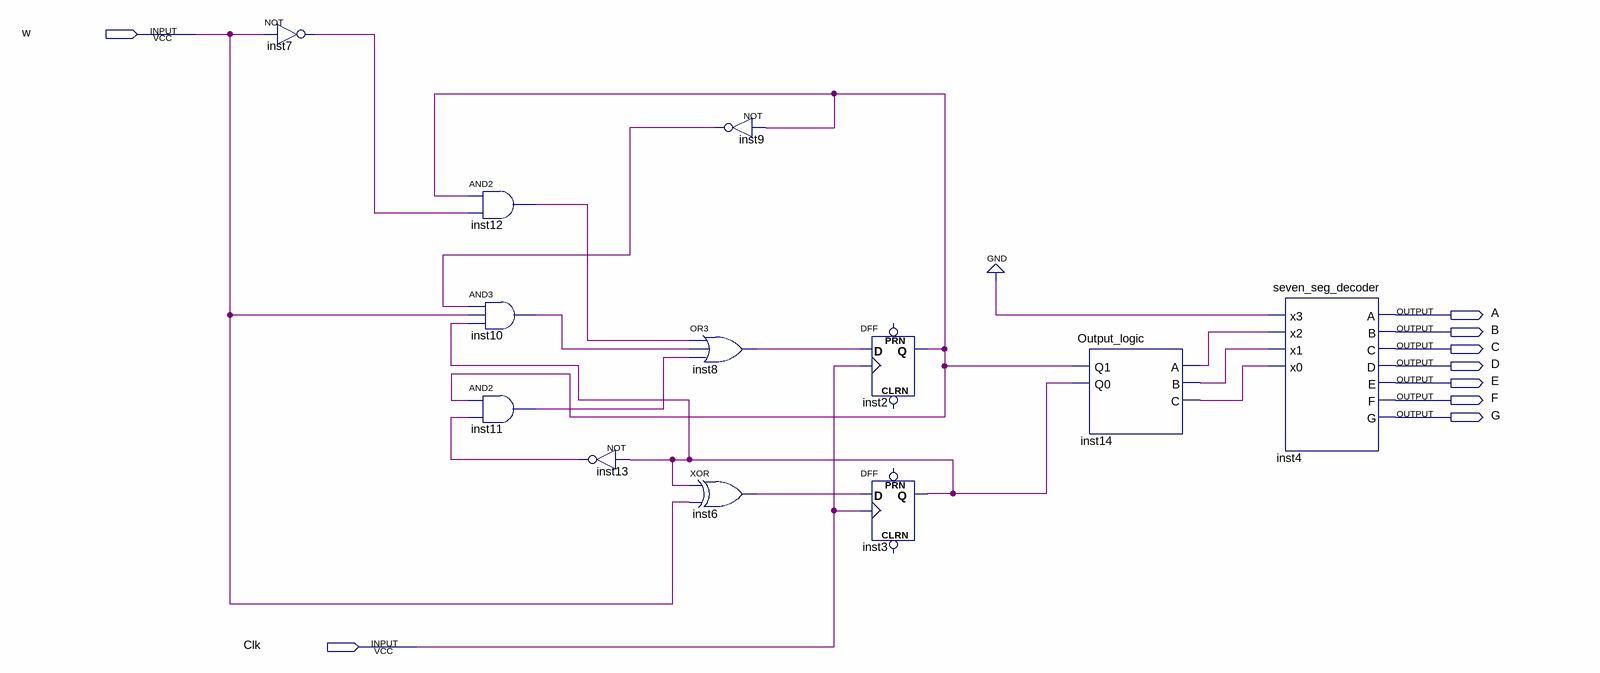
[diagram p0: schematic sheet]
// Quartus schematic lab11step2.bdf as structural Verilog: 12 symbols, 9 pins
module lab11step2 (
  input  w,
  input  Clk,
  output A,
  output B,
  output C,
  output D,
  output E,
  output F,
  output G
);

  wire inst2_q, inst3_q, inst6_out, inst7_out, inst8_out, inst9_out, inst10_out, inst11_out, inst12_out,
       inst13_out, inst14_a, inst14_b, inst14_c;

  not inst7 (inst7_out, w);
  and inst12 (inst12_out, inst2_q, inst7_out);
  and inst10 (inst10_out, inst9_out, w, inst3_q);
  and inst11 (inst11_out, inst2_q, inst13_out);
  not inst13 (inst13_out, inst3_q);
  not inst9 (inst9_out, inst2_q);
  or inst8 (inst8_out, inst12_out, inst10_out, inst11_out);
  xor inst6 (inst6_out, inst3_q, w);
  DFF inst2 (.CLK(Clk), .D(inst8_out), .Q(inst2_q));  // open: CLRN, PRN
  DFF inst3 (.CLK(Clk), .D(inst6_out), .Q(inst3_q));  // open: CLRN, PRN
  Output_logic inst14 (.Q1(inst2_q), .Q0(inst3_q), .A(inst14_a), .B(inst14_b), .C(inst14_c));
  seven_seg_decoder inst4 (
    .x3(1'b0), .x2(inst14_a), .x1(inst14_b), .x0(inst14_c), .A(A), .B(B), .C(C), .D(D), .E(E), .F(F), .G(G));
endmodule
